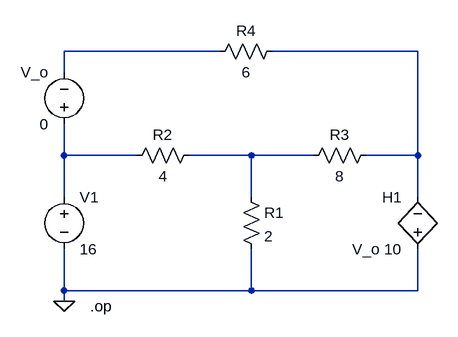
[diagram p0: schematic CH03-KP1-09.asc]
CH03-KP1-09.asc, the LTspice schematic file:
Version 4
SHEET 1 880 680
WIRE 240 192 0 192
WIRE 544 192 320 192
WIRE 0 224 0 192
WIRE 0 352 0 304
WIRE 112 352 0 352
WIRE 288 352 192 352
WIRE 384 352 288 352
WIRE 544 352 544 192
WIRE 544 352 464 352
WIRE 0 416 0 352
WIRE 288 416 288 352
WIRE 544 416 544 352
WIRE 0 560 0 496
WIRE 288 560 288 496
WIRE 288 560 0 560
WIRE 544 560 544 496
WIRE 544 560 288 560
WIRE 0 576 0 560
FLAG 0 576 0
SYMBOL voltage 0 400 R0
SYMATTR InstName V1
SYMATTR Value 16
SYMBOL res 272 400 R0
SYMATTR InstName R1
SYMATTR Value 2
SYMBOL res 208 336 R90
WINDOW 0 0 56 VBottom 2
WINDOW 3 32 56 VTop 2
SYMATTR InstName R2
SYMATTR Value 4
SYMBOL res 480 336 R90
WINDOW 0 0 56 VBottom 2
WINDOW 3 32 56 VTop 2
SYMATTR InstName R3
SYMATTR Value 8
SYMBOL res 336 176 R90
WINDOW 0 0 56 VBottom 2
WINDOW 3 32 56 VTop 2
SYMATTR InstName R4
SYMATTR Value 6
SYMBOL voltage 0 320 R180
WINDOW 0 24 96 Left 2
WINDOW 3 24 16 Left 2
SYMATTR InstName V_o
SYMATTR Value 0
SYMBOL h 544 512 R180
WINDOW 0 24 96 Left 2
WINDOW 3 24 16 Left 2
SYMATTR InstName H1
SYMATTR Value V_o 10
TEXT 40 584 Left 2 !.op

The netlist it stands for:
* CH03-KP1-09.asc
V1 N003 0 16
R1 N004 0 2
R2 N004 N003 4
R3 N002 N004 8
R4 N002 N001 6
V_o N003 N001 0
H1 0 N002 V_o 10
.op
.backanno
.end